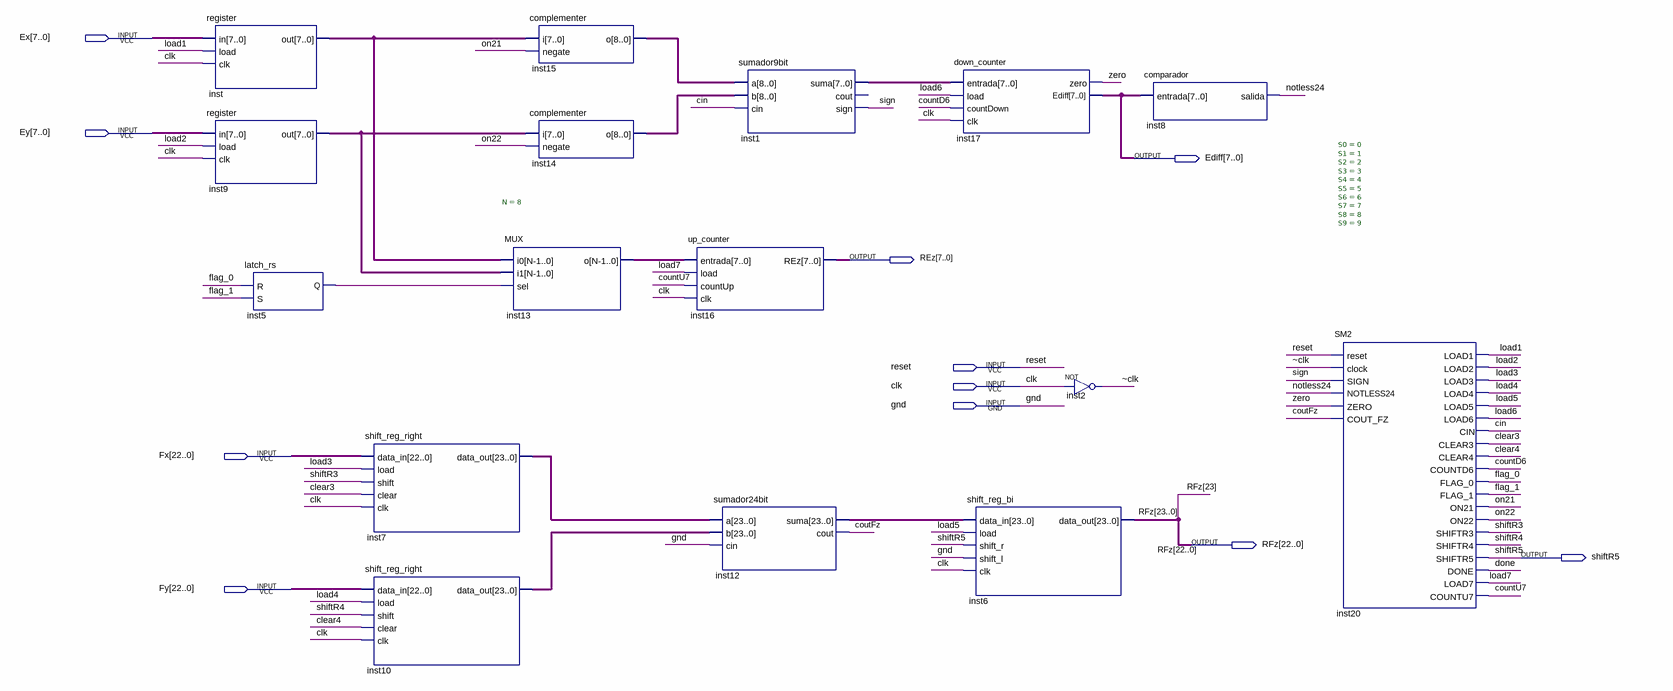
[diagram p0: schematic sheet]
// Quartus schematic DTCI.bdf as structural Verilog: 16 symbols, 11 pins
module DTCI (
  input  [7:0] Ex,
  input  [7:0] Ey,
  input  reset,
  input  clk,
  input  gnd,
  input  [22:0] Fx,
  input  [22:0] Fy,
  output [7:0] Ediff,
  output [7:0] REz,
  output [23:0] RFz,
  output shiftR5
);

  wire cin, clear3, clear4, countD6, countU7, coutFz, done, flag_0, flag_1, inst5_q, load1, load2, load3,
       load4, load5, load6, load7, notless24, on21, on22, shiftR3, shiftR4, sign, zero, \~clk ;
  wire [7:0] inst1_suma, inst9_out, inst13_o, inst_out;
  wire [8:0] inst14_o, inst15_o;
  wire [23:0] inst7_data_out, inst10_data_out, inst12_suma;

  register inst (.in(Ex), .load(load1), .clk(clk), .out(inst_out));
  register inst9 (.in(Ey), .load(load2), .clk(clk), .out(inst9_out));
  latch_rs inst5 (.R(flag_0), .S(flag_1), .Q(inst5_q));
  shift_reg_right inst7 (
    .data_in(Fx), .load(load3), .shift(shiftR3), .clear(clear3), .clk(clk), .data_out(inst7_data_out));
  shift_reg_right inst10 (
    .data_in(Fy), .load(load4), .shift(shiftR4), .clear(clear4), .clk(clk), .data_out(inst10_data_out));
  MUX #(.N(8)) inst13 (.i0(inst_out), .i1(inst9_out), .sel(inst5_q), .o(inst13_o));
  complementer inst15 (.i(inst_out), .negate(on21), .o(inst15_o));
  complementer inst14 (.i(inst9_out), .negate(on22), .o(inst14_o));
  up_counter inst16 (.entrada(inst13_o), .load(load7), .countUp(countU7), .clk(clk), .REz(REz));
  sumador24bit inst12 (.a(inst7_data_out), .b(inst10_data_out), .cin(gnd), .suma(inst12_suma), .cout(coutFz));
  sumador9bit inst1 (.a(inst15_o), .b(inst14_o), .cin(cin), .suma(inst1_suma), .sign(sign));  // open: cout
  down_counter inst17 (.entrada(inst1_suma), .load(load6), .countDown(countD6), .clk(clk), .zero(zero), .Ediff(Ediff));
  shift_reg_bi inst6 (.data_in(inst12_suma), .load(load5), .shift_r(shiftR5), .shift_l(gnd), .clk(clk), .data_out(RFz));
  not inst2 (\~clk , clk);
  comparador inst8 (.entrada(Ediff), .salida(notless24));
  SM2 #(.S0(0), .S1(1), .S2(2), .S3(3), .S4(4), .S5(5), .S6(6), .S7(7), .S8(8), .S9(9)) inst20 (
    .reset(reset), .clock(\~clk ), .SIGN(sign), .NOTLESS24(notless24), .ZERO(zero), .COUT_FZ(coutFz),
    .LOAD1(load1), .LOAD2(load2), .LOAD3(load3), .LOAD4(load4), .LOAD5(load5), .LOAD6(load6), .CIN(cin),
    .CLEAR3(clear3), .CLEAR4(clear4), .COUNTD6(countD6), .FLAG_0(flag_0), .FLAG_1(flag_1), .ON21(on21),
    .ON22(on22), .SHIFTR3(shiftR3), .SHIFTR4(shiftR4), .SHIFTR5(shiftR5), .DONE(done), .LOAD7(load7),
    .COUNTU7(countU7));
endmodule
